# EAGLE design sdmapper (EAGLE 9.6.2)
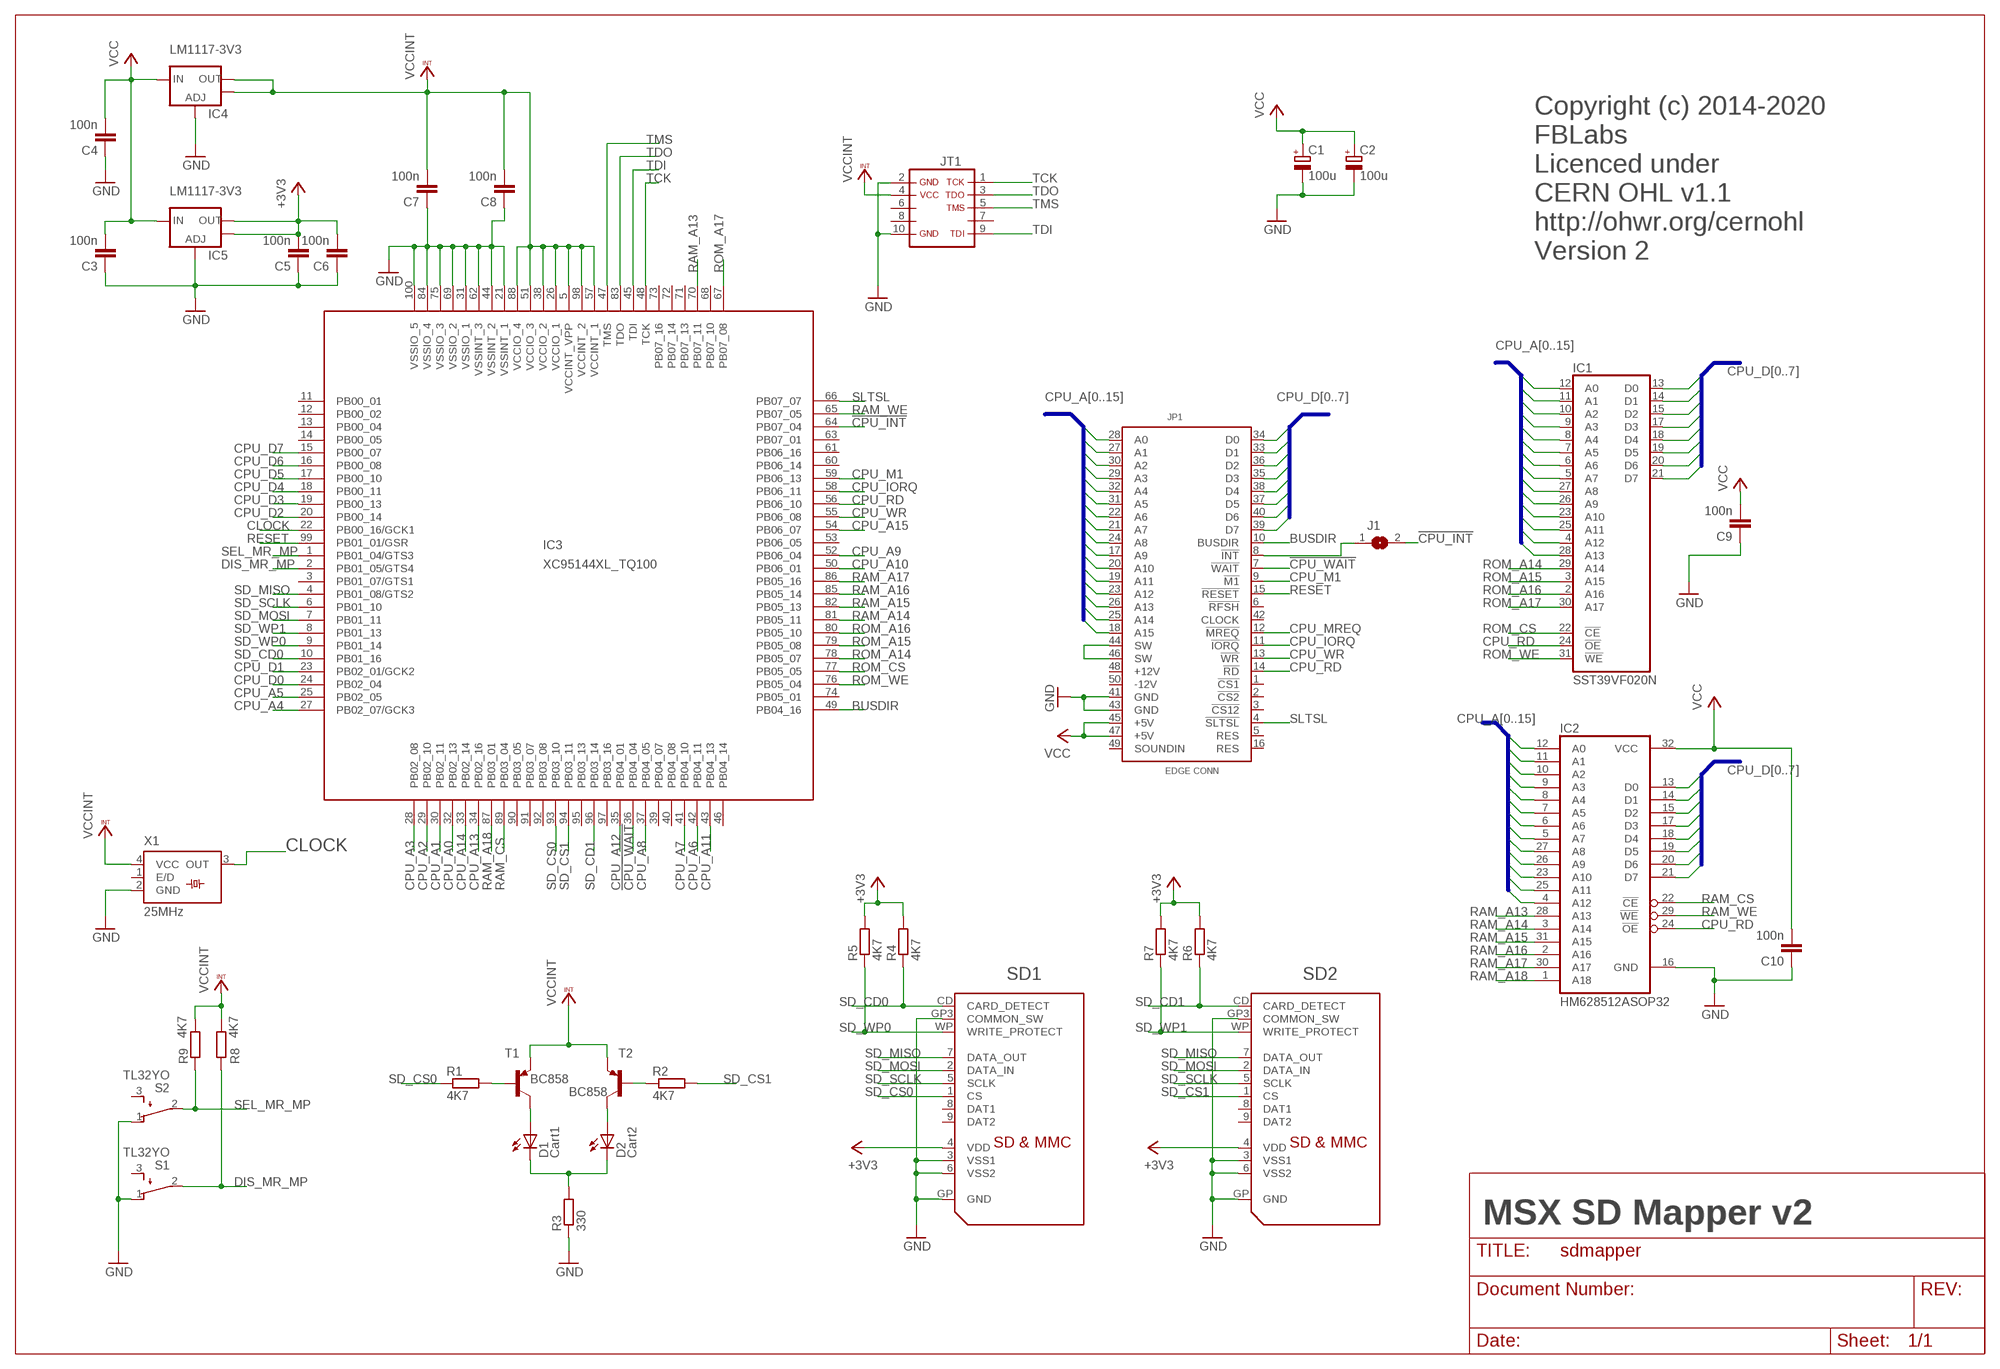
[diagram p0: schematic, sheet 1]

## Parts
C1  100u  CPOL-EUE3,5-6  [E3,5-6]
C2  100u  CPOL-EUC  [PANASONIC_C]
C3  100n  C-EUC0805  [C0805]
C4  100n  C-EUC0805  [C0805]
C5  100n  C-EUC0805  [C0805]
C6  100n  C-EUC0805  [C0805]
C7  100n  C-EUC0805  [C0805]
C8  100n  C-EUC0805  [C0805]
C9  100n  C-EUC0805  [C0805]
C10  100n  C-EUC0805  [C0805]
D1  Cart1  LED3MM  [LED3MM]
D2  Cart2  LED3MM  [LED3MM]
IC1  SST39VF020N  [PLCC32R]
IC2  HM628512ASOP32  [SOP32]
IC3  XC95144XL_TQ100  [XC-TQ100]
IC4  LM1117-3V3  V_REG_LM1117SOT223  [SOT223]
IC5  LM1117-3V3  V_REG_LM1117SOT223  [SOT223]
J1  SJ4  [SJ20]
JP1  MSXCART1  [MSXCART]
JT1  JTAG1B  [SMD5X2]
R1  4K7  R-EU_R0805  [R0805]
R2  4K7  R-EU_R0805  [R0805]
R3  330  R-EU_R0805  [R0805]
R4  4K7  R-EU_R0805  [R0805]
R5  4K7  R-EU_R0805  [R0805]
R6  4K7  R-EU_R0805  [R0805]
R7  4K7  R-EU_R0805  [R0805]
R8  4K7  R-EU_R0805  [R0805]
R9  4K7  R-EU_R0805  [R0805]
S1  TL32YO  [TL3XYO]
S2  TL32YO  [TL3XYO]
SD1  SDMMC06132  [06132]
SD2  SDMMC06132  [06132]
T1  BC858  BC858A-PNP-SOT23-BEC  [SOT23-BEC]
T2  BC858  BC858A-PNP-SOT23-BEC  [SOT23-BEC]
X1  25MHz  SM77H  [SM77H]

## Nets
!CPU_INT: IC3.64(PB07_04) J1.2
!CPU_WAIT: IC3.36(PB04_04) JP1.7(!WAIT)
+3V3 [power]: C5.2 C6.2 IC5.2(OUT) IC5.4(OUT) R4.2 R5.2 R6.2 R7.2 SD1.4(VDD) SD2.4(VDD)
BUSDIR: IC3.49(PB04_16) JP1.10(BUSDIR)
CLOCK: IC3.22(PB00_16/GCK1) X1.3(OUT)
CPU_A0: IC1.12(A0) IC2.12(A0) IC3.32(PB02_13) JP1.28(A0)
CPU_A1: IC1.11(A1) IC2.11(A1) IC3.30(PB02_11) JP1.27(A1)
CPU_A2: IC1.10(A2) IC2.10(A2) IC3.29(PB02_10) JP1.30(A2)
CPU_A3: IC1.9(A3) IC2.9(A3) IC3.28(PB02_08) JP1.29(A3)
CPU_A4: IC1.8(A4) IC2.8(A4) IC3.27(PB02_07/GCK3) JP1.32(A4)
CPU_A5: IC1.7(A5) IC2.7(A5) IC3.25(PB02_05) JP1.31(A5)
CPU_A6: IC1.6(A6) IC2.6(A6) IC3.42(PB04_11) JP1.22(A6)
CPU_A7: IC1.5(A7) IC2.5(A7) IC3.41(PB04_10) JP1.21(A7)
CPU_A8: IC1.27(A8) IC2.27(A8) IC3.37(PB04_05) JP1.24(A8)
CPU_A9: IC1.26(A9) IC2.26(A9) IC3.52(PB06_04) JP1.17(A9)
CPU_A10: IC1.23(A10) IC2.23(A10) IC3.50(PB06_01) JP1.20(A10)
CPU_A11: IC1.25(A11) IC2.25(A11) IC3.43(PB04_13) JP1.19(A11)
CPU_A12: IC1.4(A12) IC2.4(A12) IC3.35(PB04_01) JP1.23(A12)
CPU_A13: IC1.28(A13) IC3.34(PB02_16) JP1.26(A13)
CPU_A14: IC3.33(PB02_14) JP1.25(A14)
CPU_A15: IC3.54(PB06_07) JP1.18(A15)
CPU_D0: IC1.13(D0) IC2.13(D0) IC3.24(PB02_04) JP1.34(D0)
CPU_D1: IC1.14(D1) IC2.14(D1) IC3.23(PB02_01/GCK2) JP1.33(D1)
CPU_D2: IC1.15(D2) IC2.15(D2) IC3.20(PB00_14) JP1.36(D2)
CPU_D3: IC1.17(D3) IC2.17(D3) IC3.19(PB00_13) JP1.35(D3)
CPU_D4: IC1.18(D4) IC2.18(D4) IC3.18(PB00_11) JP1.38(D4)
CPU_D5: IC1.19(D5) IC2.19(D5) IC3.17(PB00_10) JP1.37(D5)
CPU_D6: IC1.20(D6) IC2.20(D6) IC3.16(PB00_08) JP1.40(D6)
CPU_D7: IC1.21(D7) IC2.21(D7) IC3.15(PB00_07) JP1.39(D7)
CPU_IORQ: IC3.58(PB06_11) JP1.11(!IORQ)
CPU_M1: IC3.59(PB06_13) JP1.9(!M1)
CPU_MREQ: JP1.12(!MREQ)
CPU_RD: IC1.24(!OE) IC2.24(!OE) IC3.56(PB06_10) JP1.14(!RD)
CPU_WR: IC3.55(PB06_08) JP1.13(!WR)
DIS_MR_MP: IC3.2(PB01_05/GTS4) R8.1 S1.2(P)
GND [power]: C1.- C2.- C3.1 C4.1 C5.1 C6.1 C7.1 C8.1 C9.1 C10.1 IC2.16(GND) IC3.21(VSSINT_1) IC3.31(VSSIO_1) IC3.44(VSSINT_2) IC3.62(VSSINT_3) IC3.69(VSSIO_2) IC3.75(VSSIO_3) IC3.84(VSSIO_4) IC3.100(VSSIO_5) IC4.1(ADJ) IC5.1(ADJ) JP1.41(GND) JP1.43(GND) JT1.2 JT1.10 R3.1 S1.1(O) S2.1(O) SD1.3(VSS1) SD1.6(VSS2) SD1.GP3(COMMON_SW) SD1.GP(GND) SD2.3(VSS1) SD2.6(VSS2) SD2.GP3(COMMON_SW) SD2.GP(GND) X1.2(GND)
N$1: JP1.44(SW) JP1.46(SW)
N$2: J1.1 JP1.8(!INT)
N$4: R1.2 T1.B
N$5: R2.1 T2.B
N$7: D1.K(C) D2.K(C) R3.2
N$8: D1.A T1.C
N$9: D2.A T2.C
RAM_A13: IC2.28(A13) IC3.70(PB07_11)
RAM_A14: IC2.3(A14) IC3.81(PB05_11)
RAM_A15: IC2.31(A15) IC3.82(PB05_13)
RAM_A16: IC2.2(A16) IC3.85(PB05_14)
RAM_A17: IC2.30(A17) IC3.86(PB05_16)
RAM_A18: IC2.1(A18) IC3.87(PB03_01)
RAM_CS: IC2.22(!CE) IC3.89(PB03_04)
RAM_WE: IC2.29(!WE) IC3.65(PB07_05)
RESET: IC3.99(PB01_01/GSR) JP1.15(!RESET)
ROM_A14: IC1.29(A14) IC3.78(PB05_07)
ROM_A15: IC1.3(A15) IC3.79(PB05_08)
ROM_A16: IC1.2(A16) IC3.80(PB05_10)
ROM_A17: IC1.30(A17) IC3.67(PB07_08)
ROM_CS: IC1.22(!CE) IC3.77(PB05_05)
ROM_WE: IC1.31(!WE) IC3.76(PB05_04)
SD_CD0: IC3.10(PB01_16) R4.1 SD1.CD(CARD_DETECT)
SD_CD1: IC3.96(PB03_14) R6.1 SD2.CD(CARD_DETECT)
SD_CS0: IC3.93(PB03_10) R1.1 SD1.1(CS)
SD_CS1: IC3.94(PB03_11) R2.2 SD2.1(CS)
SD_MISO: IC3.4(PB01_08/GTS2) SD1.7(DATA_OUT) SD2.7(DATA_OUT)
SD_MOSI: IC3.7(PB01_11) SD1.2(DATA_IN) SD2.2(DATA_IN)
SD_SCLK: IC3.6(PB01_10) SD1.5(SCLK) SD2.5(SCLK)
SD_WP0: IC3.9(PB01_14) R5.1 SD1.WP(WRITE_PROTECT)
SD_WP1: IC3.8(PB01_13) R7.1 SD2.WP(WRITE_PROTECT)
SEL_MR_MP: IC3.1(PB01_04/GTS3) R9.1 S2.2(P)
SLTSL: IC3.66(PB07_07) JP1.4(!SLTSL)
TCK: IC3.48(TCK) JT1.1
TDI: IC3.45(TDI) JT1.9
TDO: IC3.83(TDO) JT1.3
TMS: IC3.47(TMS) JT1.5
VCC [power]: C1.+ C2.+ C3.2 C4.2 C9.2 C10.2 IC2.32(VCC) IC4.3(IN) IC5.3(IN) JP1.45(+5V) JP1.47(+5V)
VCCINT [power]: C7.2 C8.2 IC3.5(VCCINT_VPP) IC3.26(VCCIO_1) IC3.38(VCCIO_2) IC3.51(VCCIO_3) IC3.57(VCCINT_1) IC3.88(VCCIO_4) IC3.98(VCCINT_2) IC4.2(OUT) IC4.4(OUT) JT1.4 R8.2 R9.2 T1.E T2.E X1.4(VCC)
Unconnected: IC3.3(PB01_07/GTS1) IC3.11(PB00_01) IC3.12(PB00_02) IC3.13(PB00_04) IC3.14(PB00_05) IC3.39(PB04_07) IC3.40(PB04_08) IC3.46(PB04_14) IC3.53(PB06_05) IC3.60(PB06_14) IC3.61(PB06_16) IC3.63(PB07_01) IC3.68(PB07_10) IC3.71(PB07_13) IC3.72(PB07_14) IC3.73(PB07_16) IC3.74(PB05_01) IC3.90(PB03_05) IC3.91(PB03_07) IC3.92(PB03_08) IC3.95(PB03_13) IC3.97(PB03_16) JP1.1(!CS1) JP1.2(!CS2) JP1.3(!CS12) JP1.5(RES) JP1.6(!RFSH) JP1.16(RES) JP1.42(CLOCK) JP1.48(+12V) JP1.49(SOUNDIN) JP1.50(-12V) JT1.6 JT1.7 JT1.8 S1.3(S) S2.3(S) SD1.8(DAT1) SD1.9(DAT2) SD2.8(DAT1) SD2.9(DAT2) X1.1(E/D)

## Buses
CPU_A[0..15]
CPU_D[0..7]

## Notes on the sheet
- Copyright (c) 2014-2020
  FBLabs
  Licenced under
  CERN OHL v1.1
  http://ohwr.org/cernohl
  Version 2
- SD1 | SD2
- MSX SD Mapper v2

## Power pins joined to a net without a drawn wire
GND: IC1.16(GND)
VCC: IC1.32(VCC)

## Library data of the parts
C1 = rcl2:CPOL-EU: POLARIZED CAPACITOR, European symbol
C2 = rcl:CPOL-EU: POLARIZED CAPACITOR, European symbol
C3-C10 = rcl:C-EU: CAPACITOR, European symbol
D1 D2 = led:LED: LED OSRAM: - CHIPLED LG R971, LG N971, LY N971, LG Q971, LY Q971, LO R971, LY R971 LH N974, LH R974 LS Q976, LO Q976, LY Q976 LO Q996 - Hyper CHIPLED LW Q18S LB Q993, LB Q99A, LB R99A - SideLED LS A670, LO A670, LY A670, LG A670, LP A670 LB A673, LV A673, LT A673, LW A673 LH A674 LY A675 LS A676, LA A676, LO A676, LY A676, LW A676 LS A679, LY A679, LG A679 - Hyper Micro SIDELED® LS Y876, LA Y876, LO Y876, LY Y876 LT Y87S - SmartLED LW L88C, LW L88S LB L89C, LB L89S, LG L890 LS L89K, LO L89K, LY L89K LS L896, LA L896, LO L896, LY L896 - TOPLED LS T670, LO T670, LY T670, LG T670, LP T670 LSG T670, LSP T670, LSY T670, LOP T670, LYG T670 LG T671, LOG T671, LSG T671 LB T673, LV T673, LT T673, LW T673 LH T674 LS T676, LA T676, LO T676, LY T676, LB T676, LH T676, LSB T676, LW T676 LB T67C, LV T67C, LT T67C, LS T67K, LO T67K, LY T67K, LW E67C LS E67B, LA E67B, LO E67B, LY E67B, LB E67C, LV E67C, LT E67C LW T67C LS T679, LY T679, LG T679 LS T770, LO T770, LY T770, LG T770, LP T770 LB T773, LV T773, LT T773, LW T773 LH T774 LS E675, LA E675, LY E675, LS T675 LS T776, LA T776, LO T776, LY T776, LB T776 LHGB T686 LT T68C, LB T68C - Hyper Mini TOPLED® LB M676 - Mini TOPLED Santana® LG M470 LS M47K, LO M47K, LY M47K Source: http://www.osram.convergy.de LUXEON: - LUMILED® LXK2-PW12-R00, LXK2-PW12-S00, LXK2-PW14-U00, LXK2-PW14-V00 LXK2-PM12-R00, LXK2-PM12-S00, LXK2-PM14-U00 LXK2-PE12-Q00, LXK2-PE12-R00, LXK2-PE12-S00, LXK2-PE14-T00, LXK2-PE14-U00 LXK2-PB12-K00, LXK2-PB12-L00, LXK2-PB12-M00, LXK2-PB14-N00, LXK2-PB14-P00, LXK2-PB14-Q00 LXK2-PR12-L00, LXK2-PR12-M00, LXK2-PR14-Q00, LXK2-PR14-R00 LXK2-PD12-Q00, LXK2-PD12-R00, LXK2-PD12-S00 LXK2-PH12-R00, LXK2-PH12-S00 LXK2-PL12-P00, LXK2-PL12-Q00, LXK2-PL12-R00 Source: www.luxeon.com KINGBRIGHT: KA-3528ASYC Source: www.kingbright.com
IC1 = memory:SST39VF020: 2 Mbit x8 Multi-Purpose Flash Source: http://www.sst.com/dotAsset/40782.pdf
IC2 = hitachi_sram_hm628512a-series_rev1:HM628512A: 4M SRAM 512kword x 8bit
IC3 = XC:XC95144XL_TQ100: xc95144xl_tq100 edit this description Auto generated by make-symbol-device-package-bsdl.ulp Rev. 34 Source: xc95144xl_tq100.bsd
IC4 IC5 = SparkFun-PowerIC:V_REG_LM1117: Voltage Regulator LM1117 Standard adjustable voltage regulator but in SMD form. Spark Fun Electronics SKU : COM-00595
J1 = fabio:SJ: SMD solder JUMPER
JP1 = msx-con:MSXCART
JT1 = JTAGs:JTAG1: PIN HEADER
R1-R9 = rcl:R-EU_: RESISTOR, European symbol
S1 S2 = comps:TL32YO: TINY SWITCH ON - MOM Source: http://www2.produktinfo.conrad.com/datenblaetter/700000-724999/705152-da-01-de-Subminiaturschalter_TL_36YO.pdf
SD1 SD2 = adafruit:SDMMC: SD MMC Card holder 4UCON part #06132 - easy to solder
T1 T2 = transistor:*-PNP-: PNP Transistror
X1 = comps:SM77H: 3.3V CMOS Clock Oscillator Source: www.pletronics.com .. sm77h%203.3v.pdf; OC_FARNELL: unknown; OC_NEWARK: unknown

## Net classes
0 default: width 0.152 mm, drill 0.381 mm
1 power: width 0.406 mm, drill 0.5 mm

## Board
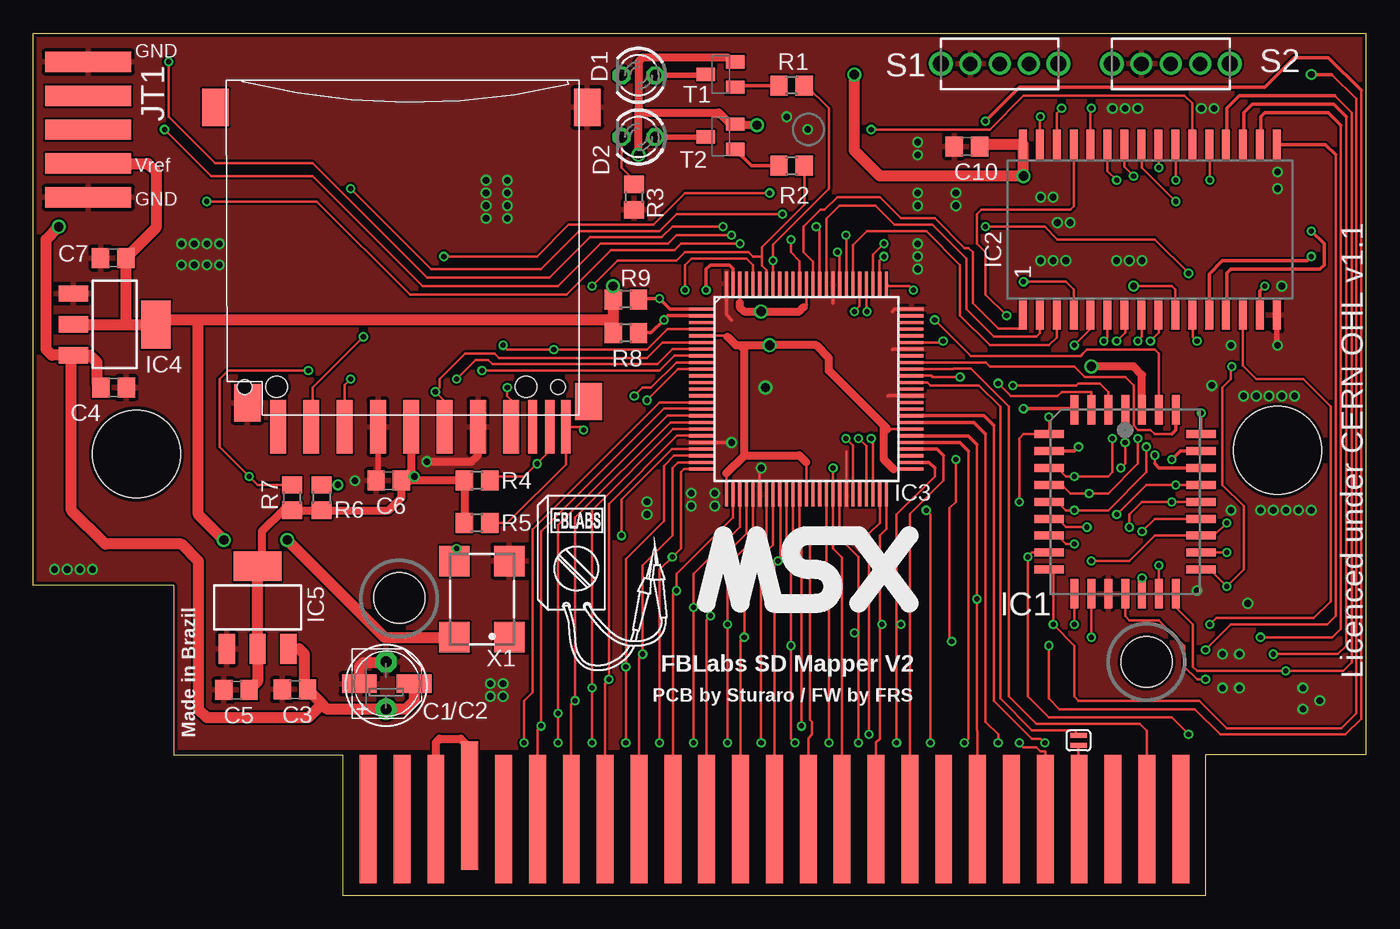
[diagram p1: board, top side]
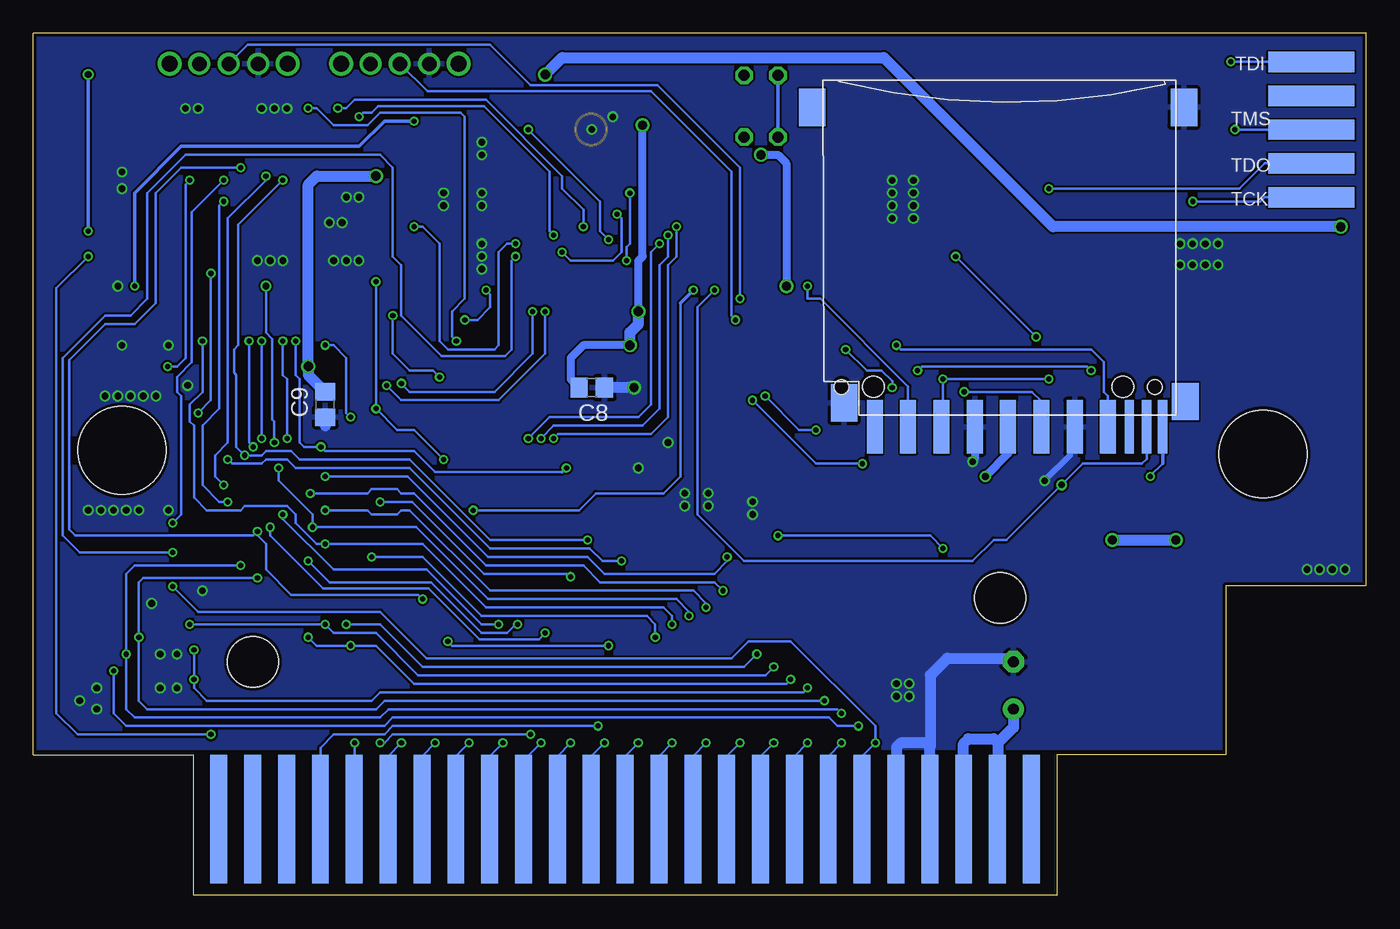
[diagram p2: board, bottom side, seen from below]

Size 100 x 64.68 mm. Coordinates in mm from the lower left corner, seen from the top.
Copper layers (1*16): Top 0.035mm / dielectric 1.5mm / Bottom 0.035mm
Design rules "ITEADstudio(6mil) *": minimum track width 6mil, minimum drill 12mil, track to track 6mil, track to pad 6mil, pad to pad 6mil, via to via 6mil, smd to smd 0mil, copper to edge 10mil, drill to drill 10mil, minimum pad ring 10mil, minimum via ring 6mil, stop-mask expansion 2mil, vias tented up to drill 100mil, thermal gap 10mil

### Footprints (pad centres in the part's own frame; a part is rotated, then mirrored left to right if it is on the bottom)
E3,5-6 = drill 0.813 pad 1.6: + -1.778,0 | drill 0.813 pad 1.6 octagon: - 1.778,0
PANASONIC_C = smd 2.6 x 1.4: + 2.05,0; - -2.05,0
C0805 = smd 1.3 x 1.5: 1 -0.95,0; 2 0.95,0
LED3MM = drill 0.813 octagon: A -1.27,0; K 1.27,0
PLCC32R = smd 0.6 x 2.2: 1 0,6.9; 2 -1.27,6.9; 3 -2.54,6.9; 4 -3.81,6.9; 14 -3.81,-6.9; 15 -2.54,-6.9; 16 -1.27,-6.9; 17 0,-6.9; 18 1.27,-6.9; 19 2.54,-6.9; 20 3.81,-6.9; 30 3.81,6.9; 31 2.54,6.9; 32 1.27,6.9 | smd 2.2 x 0.6: 5 -5.7,5.08; 6 -5.7,3.81; 7 -5.7,2.54; 8 -5.7,1.27; 9 -5.7,0; 10 -5.7,-1.27; 11 -5.7,-2.54; 12 -5.7,-3.81; 13 -5.7,-5.08; 21 5.7,-5.08; 22 5.7,-3.81; 23 5.7,-2.54; 24 5.7,-1.27; 25 5.7,0; 26 5.7,1.27; 27 5.7,2.54; 28 5.7,3.81; 29 5.7,5.08
SOP32 = smd 0.6 x 2.2: 1 -9.525,-5.765; 2 -8.255,-5.765; 3 -6.985,-5.765; 4 -5.715,-5.765; 5 -4.445,-5.765; 6 -3.175,-5.765; 7 -1.905,-5.765; 8 -0.635,-5.765; 9 0.635,-5.765; 10 1.905,-5.765; 11 3.175,-5.765; 12 4.445,-5.765; 13 5.715,-5.765; 14 6.985,-5.765; 15 8.255,-5.765; 16 9.525,-5.765; 17 9.525,7.035; 18 8.255,7.035; 19 6.985,7.035; 20 5.715,7.035; 21 4.445,7.035; 22 3.175,7.035; 23 1.905,7.035; 24 0.635,7.035; 25 -0.635,7.035; 26 -1.905,7.035; 27 -3.175,7.035; 28 -4.445,7.035; 29 -5.715,7.035; 30 -6.985,7.035; 31 -8.255,7.035; 32 -9.525,7.035
XC-TQ100 = smd 1.8 x 0.241: 1 -7.9,6; 2 -7.9,5.5; 3 -7.9,5; 4 -7.9,4.5; 5 -7.9,4; 6 -7.9,3.5; 7 -7.9,3; 8 -7.9,2.5; 9 -7.9,2; 10 -7.9,1.5; 11 -7.9,1; 12 -7.9,0.5; 13 -7.9,0; 14 -7.9,-0.5; 15 -7.9,-1; 16 -7.9,-1.5; 17 -7.9,-2; 18 -7.9,-2.5; 19 -7.9,-3; 20 -7.9,-3.5; 21 -7.9,-4; 22 -7.9,-4.5; 23 -7.9,-5; 24 -7.9,-5.5; 25 -7.9,-6; 51 7.9,-6; 52 7.9,-5.5; 53 7.9,-5; 54 7.9,-4.5; 55 7.9,-4; 56 7.9,-3.5; 57 7.9,-3; 58 7.9,-2.5; 59 7.9,-2; 60 7.9,-1.5; 61 7.9,-1; 62 7.9,-0.5; 63 7.9,0; 64 7.9,0.5; 65 7.9,1; 66 7.9,1.5; 67 7.9,2; 68 7.9,2.5; 69 7.9,3; 70 7.9,3.5; 71 7.9,4; 72 7.9,4.5; 73 7.9,5; 74 7.9,5.5; 75 7.9,6 | smd 0.241 x 1.8: 26 -6,-7.9; 27 -5.5,-7.9; 28 -5,-7.9; 29 -4.5,-7.9; 30 -4,-7.9; 31 -3.5,-7.9; 32 -3,-7.9; 33 -2.5,-7.9; 34 -2,-7.9; 35 -1.5,-7.9; 36 -1,-7.9; 37 -0.5,-7.9; 38 0,-7.9; 39 0.5,-7.9; 40 1,-7.9; 41 1.5,-7.9; 42 2,-7.9; 43 2.5,-7.9; 44 3,-7.9; 45 3.5,-7.9; 46 4,-7.9; 47 4.5,-7.9; 48 5,-7.9; 49 5.5,-7.9; 50 6,-7.9; 76 6,7.9; 77 5.5,7.9; 78 5,7.9; 79 4.5,7.9; 80 4,7.9; 81 3.5,7.9; 82 3,7.9; 83 2.5,7.9; 84 2,7.9; 85 1.5,7.9; 86 1,7.9; 87 0.5,7.9; 88 0,7.9; 89 -0.5,7.9; 90 -1,7.9; 91 -1.5,7.9; 92 -2,7.9; 93 -2.5,7.9; 94 -3,7.9; 95 -3.5,7.9; 96 -4,7.9; 97 -4.5,7.9; 98 -5,7.9; 99 -5.5,7.9; 100 -6,7.9
SOT223 = smd 1.219 x 2.235: 1 -2.311,-3.099; 2 0,-3.099; 3 2.311,-3.099 | smd 3.6 x 2.2: 4 0,3.099
SJ20 = smd 0.381 x 1.27: 1 -0.508,0; 2 0.254,0
MSXCART = smd 1.27 x 9.652 bottom: 1 86.081,5.715; 3 83.541,5.715; 5 81.001,5.715; 7 78.461,5.715; 9 75.921,5.715; 11 73.381,5.715; 13 70.841,5.715; 15 68.301,5.715; 17 65.761,5.715; 19 63.221,5.715; 21 60.681,5.715; 23 58.141,5.715; 25 55.601,5.715; 27 53.061,5.715; 29 50.521,5.715; 31 47.981,5.715; 33 45.441,5.715; 35 42.901,5.715; 37 40.361,5.715; 39 37.821,5.715; 41 35.281,5.715; 43 32.741,5.715; 45 30.201,5.715; 47 27.661,5.715; 49 25.121,5.715 | smd 1.27 x 9.652: 2 86.081,5.715; 4 83.541,5.715; 6 81.001,5.715; 8 78.461,5.715; 10 75.921,5.715; 12 73.381,5.715; 14 70.841,5.715; 16 68.301,5.715; 18 65.761,5.715; 20 63.221,5.715; 22 60.681,5.715; 24 58.141,5.715; 26 55.601,5.715; 28 53.061,5.715; 30 50.521,5.715; 32 47.981,5.715; 34 45.441,5.715; 36 42.901,5.715; 38 40.361,5.715; 40 37.821,5.715; 42 35.281,5.715; 44 32.741,6.731; 46 30.201,5.715; 48 27.661,5.715; 50 25.121,5.715 | hole 3.81: 27.461,22.326; 83.53,17.526 | hole 6.604: 93.349,33.388; 7.742,33.118
SMD5X2 = smd 1.524 x 6.477 bottom: 1 -5.08,3.81; 3 -2.54,3.81; 5 0,3.81; 7 2.54,3.81; 9 5.08,3.81 | smd 1.524 x 6.477: 2 -5.08,3.81; 4 -2.54,3.81; 6 0,3.81; 8 2.54,3.81; 10 5.08,3.81
R0805 = smd 1.3 x 1.5: 1 -0.95,0; 2 0.95,0
TL3XYO = drill 1.1: 1 -2.21,0; 2 0,0; 3 2.21,0 | drill 1.2: M1 -4.42,0; M2 4.42,0
06132 = smd 1.2 x 4: 1 6.9,0.9; 2 4.4,0.9; 3 1.9,0.9; 4 -0.6,0.9; 5 -3.1,0.9; 6 -5.6,0.9; 7 -8.1,0.9; 9 9.4,0.9 | smd 0.7 x 4: 8 -9.7,0.9; CD -11,0.9; WP -12.2,0.9 | smd 2 x 2.8: GP -13.8,-23.07; GP2 14.1,-23.07; GP3 11.7,-0.9; GP4 -13.9,-1 | hole 1.1: -11.6,-2.1 | hole 1.6: 9.5,-2.1
SOT23-BEC = smd 1 x 1.4: B -0.95,-1.1; C 0,1.1; E 0.95,-1.1
SM77H = smd 2.286 x 2.286: 1 -2.861,-2.056; 2 2.861,-2.056; 3 2.861,2.056; 4 -2.861,2.056

### Placement (x,y rotation side)
C1  26.47,15.75 90 top
C2  26.51,15.88 0 top
C3  19.63,15.44 0 top
C4  6.03,38.1 180 top
C5  15.24,15.4 0 top
C6  26.67,31.11 0 top
C7  5.99,47.83 0 top
C8  58.1,38.1 180 bottom
C9  78.11,36.83 90 bottom
C10  70.04,56.18 0 top
D1  45.4,61.53 180 top
D2  45.4,56.9 180 top
IC1  81.92,29.53 0 top
IC2  83.77,49.3 0 top
IC3  58,37.99 0 top
IC4  6.11,42.84 270 top
IC5  16.83,21.59 0 top
J1  78.42,11.75 90 top
JP1  0,0 0 top
JT1  7.92,57.45 90 top
R1  56.9,60.77 180 top
R2  56.9,54.74 0 top
R3  45.09,52.39 90 top
R4  33.29,31.11 180 top
R5  33.29,27.94 180 top
R6  21.62,29.84 270 top
R7  19.4,29.84 270 top
R8  44.45,42.18 180 top
R9  44.45,44.72 180 top
S1  72.5,62.39 0 top
S2  85.34,62.39 0 top
SD1  27.76,36.06 180 top
SD2  27.47,36.06 180 bottom
T1  51.56,61.59 90 top
T2  51.56,56.91 90 top
U$1  [LOGO_FABIO_SILK_400MIL]  37.78,16.83 0 top
U$3  [MSX_SILK]  58.1,24.45 0 top
X1  33.66,22.23 90 top

### Tracks (layer width: path | path; a pad name or v marks a point on that pad's centre or on a via)
!CPU_INT
  Top 0.203: IC3.64 67.08,38.49 67.31,38.26 70.96,38.26 72.55,36.67 72.55,14.76 74.93,12.38 78.11,12.38 78.42,12.06 J1.2
!CPU_WAIT  (via drill 0.38)
  Top 0.203: v57.63,12.7 57.63,26.19 57,26.82 IC3.36
  Bottom 0.203: JP1.7 78.46,11.07 77.47,12.06 73.66,12.06 73.03,12.7 v57.63,12.7
+3V3  (via drill 0.5)
  Top 0.61: SD1.4 28.36,31.86 C6.2 | v28.57,31.43 28.26,31.12 C6.2 | R5.2 R4.2 C6.2 | C6.2 27.62,30.8 27.62,29.84 26.66,28.89 R6.2 R7.2 18.73,28.89 17.14,27.3 17.14,25.01 IC5.4
  Top 0.813: IC5.4 IC5.2 16.83,16.04 C5.2
  Bottom 0.61: SD2.4 26.87,33.13 v28.57,31.43
BUSDIR  (via drill 0.38)
  Top 0.203: JP1.10 75.92,10.76 75.88,10.79 75.56,10.79 75.25,11.11 74.3,11.11 v73.98,11.43 | v62.71,12.06 62.71,27.15 63.5,27.94 IC3.49
  Bottom 0.203: v73.98,11.43 73.66,11.43 73.03,12.06 v62.71,12.06
CLOCK  (via drill 0.38)
  Top 0.203: IC3.22 47.93,33.49 44.13,29.69 v44.13,26.99 | X1.3 31.6,25.88 v31.75,26.04
  Bottom 0.203: v44.13,26.99 32.7,26.99 v31.75,26.04
CPU_A0  (via drill 0.38)
  Top 0.203: IC3.32 55,26.74 53.34,25.08 v53.34,19.37 53.06,19.09 JP1.28 | 76.83,25.72 IC1.12 74.93,25.72 v74.61,25.4 74.61,14.92 76.2,13.34 85.41,13.34 v86.68,12.06
  Top 0.254: IC2.12 88.21,46.62 89.22,47.62 95.57,47.62 v95.89,47.94
  Bottom 0.203: v53.34,19.37 53.34,20.32 53.98,20.95 66.36,20.95 70.8,25.4 v74.61,25.4 | v95.89,47.94 98.27,45.56 98.27,13.65 96.68,12.06 v86.68,12.06
CPU_A1  (via drill 0.38)
  Top 0.203: v52.07,11.43 v52.07,20.32 52.07,24.77 53.98,26.67 53.98,30.06 IC3.30 | IC1.11 76.83,26.99 77.47,26.35 v78.11,26.35 | v87.31,41.59 87,41.9 IC2.11
  Bottom 0.203: v52.07,20.32 52.07,20.95 52.7,21.59 66.04,21.59 70.8,26.35 v78.11,26.35 78.74,26.35 80.33,27.94 80.33,28.57 80.96,29.21 84.14,29.21 84.45,28.89 87,28.89 87.95,29.84 87.95,35.24 88.27,35.56 88.27,36.83 87.31,37.78 v87.31,41.59 | JP1.27 53.06,10.44 v52.07,11.43
CPU_A2  (via drill 0.38, 0.5)
  Top 0.203: IC3.29 53.5,27.15 50.8,24.45 v50.8,20.95 50.52,20.68 JP1.30 | IC1.10 76.83,28.26 77.47,27.62 v79.06,27.62 | IC2.10 85.67,45.45 85.41,45.72 v82.55,45.72 | v81.6,32.07 81.92,32.38 v81.92,33.97
  Bottom 0.203: v50.8,20.95 50.8,21.27 51.75,22.23 65.88,22.23 71.28,27.62 v79.06,27.62 79.06,28.57 81.6,31.11 v81.6,32.07 | v82.55,45.72 82.55,42.23 82.07,41.75 82.07,35.72 81.92,35.56 v81.92,33.97
CPU_A3  (via drill 0.38)
  Top 0.203: v49.53,11.43 v49.53,21.59 49.53,24.13 53.02,27.62 53.02,30.06 IC3.28 | IC1.9 76.83,29.53 77.47,28.89 v78.11,28.89 80.64,28.89 83.5,31.75 v83.5,33.66 | v83.82,41.59 84.45,42.23 84.45,43.49 IC2.9
  Bottom 0.203: v49.53,21.59 49.53,21.91 50.48,22.86 65.72,22.86 71.75,28.89 72.39,28.89 72.71,28.57 74.61,28.57 74.93,28.89 v78.11,28.89 | JP1.29 50.52,10.44 v49.53,11.43 | v83.82,41.59 83.82,33.97 v83.5,33.66
CPU_A4  (via drill 0.38)
  Top 0.203: JP1.32 47.98,22.58 v48.26,22.86 48.26,24.13 52.5,28.37 IC3.27 | IC1.8 76.09,30.67 77.28,30.67 77.79,30.16 v79.22,30.16 80.64,30.16 82.87,32.38 v82.87,34.29 | v82.87,41.59 83.19,41.91 83.19,43.49 IC2.8
  Bottom 0.203: v48.26,22.86 48.9,23.5 57.47,23.5 58.74,24.77 66.04,24.77 71.44,30.16 72.39,30.16 72.71,30.48 74.61,30.48 74.93,30.16 v79.22,30.16 | v82.87,34.29 v82.87,41.59
CPU_A5  (via drill 0.38)
  Top 0.203: v46.99,11.43 46.99,24.45 v47.94,25.4 48.58,26.04 48.58,31.75 48.81,31.99 IC3.25 | 76.83,32.07 77.47,31.43 v78.11,31.43 80.64,31.43 80.96,31.75 v80.96,34.29 | v81.28,41.59 81.92,42.23 81.92,43.49 IC2.7
  Top 0.254: IC1.7 76.83,32.07
  Bottom 0.203: v78.11,31.43 71.91,31.43 65.88,25.4 58.42,25.4 57.15,24.13 48.9,24.13 47.94,25.08 v47.94,25.4 | JP1.31 47.98,10.44 v46.99,11.43 | v80.96,34.29 80.96,38.73 81.28,39.05 v81.28,41.59
CPU_A6  (via drill 0.38)
  Top 0.203: JP1.22 60.68,25.36 60.01,26.04 60.01,30.07 IC3.42 v60.01,32.07 | IC2.6 80.59,41.86 v80.33,41.59
  Top 0.254: IC1.6 78.11,33.34 v78.42,33.66
  Bottom 0.203: 60.33,31.75 69.85,31.75 71.44,33.34 78.11,33.34 v78.42,33.66 79.69,33.66 80.01,33.97 80.01,38.73 80.33,39.05 v80.33,41.59
  Bottom 0.254: 60.33,31.75 v60.01,32.07
CPU_A7  (via drill 0.38)
  Top 0.203: v59.69,11.43 v59.69,23.9 59.5,24.1 IC3.41 | v73.98,29.53 73.98,34.29 74.3,34.61 IC1.5 76.22,35.86 v76.2,35.88 | IC2.5 79.32,42.49 v78.11,41.27
  Bottom 0.203: v73.98,29.53 71.6,29.53 66.2,24.13 59.92,24.13 v59.69,23.9 | JP1.21 60.68,10.44 v59.69,11.43 | v78.11,41.27 77.47,41.27 76.52,40.32 76.52,36.2 v76.2,35.88
CPU_A8  (via drill 0.38)
  Top 0.203: IC3.37 57.47,30.06 57.47,27.46 58.26,26.67 | JP1.24 58.14,11.79 58.42,12.06 58.42,13.02 58.26,13.18 58.26,26.67 | 58.26,26.67 v58.42,26.67 | v84.14,33.02 84.14,32.38 | IC2.27 80.59,54.34 v81.28,53.66
  Top 0.254: 84.14,32.38 84.45,32.07 IC1.27
  Bottom 0.203: v58.42,26.67 65.72,26.67 71.75,32.7 80.01,32.7 80.64,33.34 82.55,33.34 82.87,33.02 v84.14,33.02 84.77,33.66 84.77,39.05 84.93,39.21 84.93,40.96 84.61,41.27 84.61,50.32 v81.28,53.66
CPU_A9  (via drill 0.38)
  Top 0.203: v64.77,11.43 64.77,20.32 | 64.77,20.32 64.77,28.57 67.63,31.43 67.63,32.07 | v81.28,28.57 83.5,30.8 v85.72,30.8 IC1.26 | v65.09,20.32 64.77,20.32 | IC2.26 81.86,54.66 v82.55,53.98
  Top 0.254: 67.63,32.07 67.21,32.49 IC3.52
  Bottom 0.203: JP1.17 65.76,10.44 v64.77,11.43 | v81.28,28.57 81.28,28.26 77.47,24.45 70.48,24.45 66.36,20.32 v65.09,20.32 | v82.55,53.98 82.55,53.66 85.41,50.8 85.41,33.97 86.36,33.02 86.36,31.43 v85.72,30.8
CPU_A10  (via drill 0.38)
  Top 0.203: IC3.50 64,27.48 63.5,26.99 63.5,20.32 | JP1.20 63.22,11.47 63.5,11.75 63.5,20.32 | v79.38,25.08 82.23,25.08 84.14,26.99 IC1.23 88.58,26.99 v89.53,27.94 | v63.66,20.32 63.5,20.32 | v85.72,53.66 85.72,56.29 IC2.23
  Bottom 0.203: v79.38,25.08 77.79,23.5 70.17,23.5 66.36,19.68 64.45,19.68 63.82,20.32 v63.66,20.32 | v89.53,27.94 88.9,28.57 88.9,37.47 89.22,37.78 89.22,38.89 88.11,40.01 88.11,51.28 v85.72,53.66
CPU_A11  (via drill 0.38)
  Top 0.203: v61.91,11.43 61.91,19.84 | 61.91,19.84 61.91,25.4 60.5,26.82 IC3.43 | IC1.25 v85.41,29.53 83.19,29.53 82.23,28.57 v82.23,27.62 | v85.72,52.07 83.19,54.61 83.19,56.29 IC2.25 | v61.59,19.68 61.75,19.68 61.91,19.84
  Bottom 0.203: JP1.19 63.22,10.12 v61.91,11.43 | v85.41,29.53 86.04,29.53 87.31,30.8 87.31,35.24 86.04,36.51 86.04,51.75 v85.72,52.07 | v82.23,27.62 82.23,26.99 78.26,23.02 70.33,23.02 66.52,19.21 62.07,19.21 v61.59,19.68
CPU_A12  (via drill 0.38)
  Top 0.203: v57.15,11.43 56.83,11.75 v56.83,18.73 56.83,26.04 56.52,26.35 56.52,30.07 IC3.35 | v68.9,19.05 68.74,19.21 68.74,29.05 69.22,29.53 v69.22,32.7 | IC2.4 78.05,45.45 77.47,46.04 v74.3,46.04
  Top 0.254: v74.3,36.51 78.02,36.51 IC1.4
  Bottom 0.203: v56.83,18.73 68.58,18.73 v68.9,19.05 | v69.22,32.7 71.44,34.92 72.71,34.92 v74.3,36.51 v74.3,46.04 | JP1.23 58.14,10.44 v57.15,11.43
CPU_A13  (via drill 0.38)
  Top 0.203: IC3.34 56.04,30.04 56.04,25.24 v55.88,25.08 55.6,24.8 JP1.26
  Top 0.254: IC1.28 86.04,33.34 v85.41,32.7
  Bottom 0.203: v55.88,25.08 57.31,25.08 58.26,26.04 65.72,26.04 71.75,32.07 80.33,32.07 80.96,32.7 82.55,32.7 82.87,32.38 85.09,32.38 v85.41,32.7
CPU_A14  (via drill 0.38)
  Top 0.203: v54.61,11.43 54.61,25.4 55.5,26.29 IC3.33
  Bottom 0.203: JP1.25 55.6,10.44 v54.61,11.43
CPU_A15
  Top 0.203: 68.26,33.02 68.26,31.11 65.76,28.61 JP1.18
  Top 0.254: 68.26,33.02 67.8,33.49 IC3.54
CPU_D0  (via drill 0.38, 0.5)
  Top 0.178: 99.26,59.77 97.43,61.59
  Top 0.203: IC3.24 48.36,32.49 47.94,32.07 47.94,26.99 45.72,24.77 v45.72,18.1 45.44,17.82 JP1.34 | 99.26,59.77 99.26,13.65 98.15,12.54 89.53,12.54 87.47,14.61 78.42,14.61 78.11,14.92 78.11,18.73 v76.52,20.32 76.52,24.45 IC1.13
  Top 0.254: 97.43,61.59 v95.89,61.59 | v95.89,49.85 96.84,48.9 96.84,47.31 96.52,46.99 89.85,46.99 89.53,46.67 89.53,43.59 IC2.13
  Bottom 0.203: v45.72,18.1 46.67,17.14 70.8,17.14 73.98,20.32 v76.52,20.32
  Bottom 0.254: v95.89,61.59 v95.89,49.85
CPU_D1  (via drill 0.38)
  Top 0.178: IC2.14 90.75,39.74 91.76,38.73 95.29,38.73 97.35,36.67
  Top 0.203: v44.45,11.43 v44.45,17.14 44.45,25.24 47.31,28.1 47.31,32.23 48.07,32.99 IC3.23 | 97.35,36.67 97.35,22.07 96.08,20.8 88.74,20.8 v88.27,20.32 | IC1.14 v78.11,20.32
  Bottom 0.203: v44.45,17.14 45.09,16.51 71.12,16.51 74.3,19.68 77.47,19.68 v78.11,20.32 v88.27,20.32 | JP1.33 45.44,10.44 v44.45,11.43
CPU_D2  (via drill 0.38)
  Top 0.203: IC3.20 48.3,34.49 43.18,29.37 v43.18,16.19 42.9,15.91 JP1.36 | v76.2,18.73 76.2,14.76 76.99,13.97 87.15,13.97 89.06,12.06 98.42,12.06 99.62,13.26 99.62,60.4 | v79.38,19.37 IC1.15
  Top 0.254: 99.62,60.4 97.16,62.87 94.61,62.87 92.39,60.64 73.98,60.64 v71.44,58.1 | v92.39,45.72 92.02,45.35 IC2.15
  Bottom 0.203: v43.18,16.19 43.5,15.88 71.44,15.88 74.3,18.73 v76.2,18.73 78.74,18.73 v79.38,19.37
  Bottom 0.254: v71.44,58.1 73.66,58.1 75.56,56.2 88.9,56.2 92.39,52.7 v92.39,45.72
CPU_D3  (via drill 0.38)
  Top 0.203: v41.91,11.43 v41.91,15.56 41.91,28.89 48,34.99 IC3.19 | 97.71,55.56 97.71,20.95 97.08,20.32 89.85,20.32 v87.95,18.41 | IC1.17 81.92,20.95 82.23,20.64 84.45,20.64 86.36,18.73 86.36,17.14 87.31,16.19 v87.95,16.19
  Top 0.254: IC2.17 96.94,56.34 97.71,55.56
  Bottom 0.203: v41.91,15.56 42.23,15.24 73.98,15.24 74.61,14.61 87,14.61 87.95,15.56 v87.95,16.19 v87.95,18.41 | JP1.35 42.9,10.44 v41.91,11.43
CPU_D4  (via drill 0.38)
  Top 0.203: IC3.18 47.79,35.49 40.64,28.34 v40.64,14.61 40.36,14.33 JP1.38 | v92.08,19.37 97.47,19.37 98.11,20 98.11,57.78 | v83.19,23.81 IC1.18
  Top 0.254: 98.11,57.78 97.16,58.74 92.39,58.74 92.08,58.42 92.08,56.39 IC2.18
  Bottom 0.203: v40.64,14.61 73.66,14.61 74.3,13.97 91.44,13.97 92.08,14.61 v92.08,19.37 92.08,23.5 91.76,23.81 v83.19,23.81
CPU_D5  (via drill 0.38)
  Top 0.203: v39.37,11.43 v39.37,13.65 39.37,27.78 47.57,35.99 IC3.17 | v93.03,18.1 97.87,18.1 98.5,18.73 98.5,58.42 | v84.45,24.77 IC1.19
  Top 0.254: 98.5,58.42 97.55,59.37 91.44,59.37 90.81,58.74 90.81,56.39 IC2.19
  Bottom 0.203: v39.37,13.65 39.69,13.97 73.34,13.97 73.98,13.34 92.39,13.34 93.03,13.97 v93.03,18.1 93.03,24.13 92.39,24.77 v84.45,24.77 | JP1.37 40.36,10.44 v39.37,11.43
CPU_D6  (via drill 0.38)
  Top 0.178: 98.9,58.74 97.63,60.01
  Top 0.203: IC3.16 50.07,36.51 47.31,36.51 38.1,27.3 v38.1,12.7 37.82,12.42 JP1.40 | 98.9,58.74 98.9,17.46 98.27,16.83 v93.98,16.83 87.31,16.83 87,17.14 87,20.32 85.72,21.59 IC1.20
  Top 0.254: 97.63,60.01 90.49,60.01 89.53,59.05 89.53,56.39 IC2.20
  Bottom 0.203: v93.98,16.83 93.98,13.65 93.03,12.7 73.66,12.7 73.03,13.34 40.32,13.34 39.69,12.7 v38.1,12.7
CPU_D7  (via drill 0.38)
  Top 0.203: v36.83,11.43 36.83,14.61 37.47,15.24 37.47,27.46 46.99,36.99 IC3.15 | v88.27,53.66 88.27,56.29 | IC1.21 88.27,24.45 v89.53,23.18 90.81,24.45 90.81,29.21 89.22,30.8 89.22,38.1 89.85,38.73 89.85,39.61 v89.93,39.69
  Top 0.254: 88.27,56.29 IC2.21
  Bottom 0.203: v89.93,39.69 89.22,39.69 88.58,40.32 88.58,53.34 v88.27,53.66 | v89.53,23.18 87.63,21.27 73.98,21.27 70.48,17.78 47.62,17.78 46.35,19.05 43.18,19.05 36.83,12.7 v36.83,11.43 37.82,10.44 JP1.39
CPU_IORQ  (via drill 0.38)
  Top 0.203: v72.39,11.43 72.39,12.06 71.44,13.02 71.44,34.61
  Top 0.254: 71.44,34.61 70.56,35.49 IC3.58
  Bottom 0.203: JP1.11 73.38,10.44 v72.39,11.43
CPU_M1  (via drill 0.38)
  Top 0.203: 72.07,35.24 72.07,14.61 74.93,11.75 75.56,11.75 v75.88,11.43
  Top 0.254: 72.07,35.24 71.33,35.99 IC3.59
  Bottom 0.203: JP1.9 75.92,6.35 | 75.92,6.35 75.92,10.44 | v75.88,11.43 75.88,6.39 75.92,6.35
CPU_RD  (via drill 0.38)
  Top 0.203: 70.8,33.81 v70.8,22.23 70.8,12.38 70.84,12.34 JP1.14 | IC1.24 84.14,28.26 v83.19,27.3 | v84.45,54.61 84.45,56.29 IC2.24
  Top 0.254: 70.8,33.81 70.17,34.45 65.93,34.45 IC3.56
  Bottom 0.203: v70.8,22.23 71.12,22.54 80.64,22.54 82.55,24.45 82.55,26.35 83.19,26.99 v83.19,27.3 83.5,26.99 96.84,26.99 97.31,27.46 97.31,40.16 94.61,42.86 92.39,42.86 90.81,44.45 90.81,52.7 88.9,54.61 v84.45,54.61
CPU_WR  (via drill 0.38)
  Top 0.203: v69.85,11.43 70.17,11.75 70.17,33.34
  Top 0.254: 70.17,33.34 69.53,33.97 65.91,33.97 IC3.55
  Bottom 0.203: JP1.13 70.84,10.44 v69.85,11.43
DIS_MR_MP  (via drill 0.38)
  Top 0.254: IC3.2 47.61,43.49 v47.31,43.18 46.35,42.23 45.45,42.23 R8.1
  Bottom 0.203: v47.31,43.18 47.62,43.5 47.62,54.29 53.66,60.33 70.44,60.33 S1.2
GND  (via drill 0.5, 0.7)
  Top 0.203: IC3.44 61,33.3 | IC3.31 54.5,31.86
  Top 0.254: IC3.21 52.37,33.99 v52.39,33.97 | IC3.84 60,44.46 60.01,44.45 | IC3.75 64.62,43.99 64.45,43.81 | IC3.69 64.48,40.99 64.45,40.96 | IC3.62 64.16,37.49 64.14,37.47 | IC3.100 52,43.57 52.39,43.18 | 54.5,31.86 54.29,32.07
  Top 0.406: IC2.16 93.29,41.33 v93.34,41.27 | SD1.3 25.86,31.29
  Top 0.61: v29.53,32.54 32.86,32.54 33.34,33.02 33.34,35.13 SD1.6
  Top 0.813: C2.- 24.46,17.16 24.77,17.46 26.4,17.46 C1.-
  Bottom 0.406: SD2.6 22.19,33.05 v24.13,31.11
  Bottom 0.61: SD2.3 29.37,32.7 v29.53,32.54
  Bottom 0.813: C1.- 26.72,17.78 31.43,17.78 32.7,16.51 32.7,11.15 32.74,11.11 | JP1.43 32.74,11.11 | 32.74,11.11 32.74,11.15 33.02,11.43 34.92,11.43 35.24,11.11 35.24,5.75 JP1.41 | v54.93,38.1 C8.1 | C9.1 78.11,35.24
  other vias: 95.25,15.56 96.52,14.61 95.25,13.97 89.85,41.27 88.42,38.26 89.22,15.56 90.49,15.56 91.12,21.91 87.31,22.86 94.93,28.89 93.98,28.89 93.03,28.89 93.66,45.72 93.34,54.29 93.34,53.02 76.83,50.48 77.79,50.48 75.56,52.39 76.52,52.39 69.22,52.7 69.22,51.75 66.36,52.7 66.36,51.75 66.36,48.9 66.36,47.94 66.36,46.99 58.1,57.47 56.52,58.42 46.04,29.53 46.04,28.57 34.29,15.88 35.24,15.88 35.24,14.92 34.29,14.92 49.37,29.21 51.12,29.21 49.37,30.16 51.12,30.16 11.11,47.31 12.06,47.31 13.02,47.31 13.97,47.31 11.11,48.9 12.06,48.9 13.02,48.9 13.97,48.9 1.59,24.45 2.54,24.45 3.49,24.45 4.45,24.45 33.97,53.66 33.97,52.7 33.97,51.75 33.97,50.8 35.56,53.66 35.56,52.7 35.56,51.75 35.56,50.8 90.81,37.47 91.76,37.47 92.71,37.47 93.66,37.47 94.61,37.47 95.89,28.89 92.08,28.89 90.49,18.1 89.22,18.1 89.85,28.89 83.19,47.62 82.23,47.62 81.28,47.62 75.56,47.62 76.52,47.62 77.47,47.62 54.61,32.07 80.96,59.05 81.92,59.05 82.87,59.05 87.63,59.05 88.58,59.05 66.36,56.52 66.36,55.56
  pour Top (rank 2): -0.64,65.09 100.97,65.09 100.97,11.11 -0.64,11.11
  pour Bottom (rank 2): -1.59,66.04 101.92,66.04 101.92,11.11 -1.59,11.11
N$1
  Top 0.61: JP1.46 30.2,11.47 30.48,11.75 32.07,11.75 32.7,11.11 32.7,6.77 JP1.44
N$2
  Top 0.203: JP1.8 78.42,5.71 J1.1
N$4
  Top 0.254: R1.2 52.79,60.77 T1.B
N$5
  Top 0.254: R2.1 53.89,54.74 T2.B
N$7
  Top 0.203: D2.K 44.13,54.61 45.09,53.66 R3.2
  Bottom 0.254: D1.K D2.K
N$8
  Top 0.406: D1.A 50.4,61.53 T1.C
N$9
  Top 0.406: D2.A 50.45,56.9 T2.C
RAM_A13  (via drill 0.38)
  Top 0.203: IC2.28 79.32,59 v79.38,59.05 | IC3.70 68.16,41.49 v68.26,41.59
  Bottom 0.203: v79.38,59.05 78.74,59.05 77.47,57.78 74.93,57.78 73.98,58.74 67.94,58.74 67.63,58.42 67.63,44.77 68.58,43.81 68.58,41.91 v68.26,41.59
RAM_A14
  Top 0.203: IC2.3 76.78,41.86 76.2,41.27 71.75,41.27 69.53,43.5 69.53,47.31 66.99,49.85 62.55,49.85 61.5,48.8 IC3.81
RAM_A15  (via drill 0.38)
  Top 0.203: IC2.31 75.51,58.37 v75.56,58.42 | IC3.82 61,49.49 v60.96,49.53
  Bottom 0.203: v75.56,58.42 75.25,58.74 74.61,58.74 74.14,59.21 66.2,59.21 61.28,54.29 61.28,49.85 v60.96,49.53
RAM_A16
  Top 0.203: IC2.2 75.51,42.18 75.25,41.91 72.07,41.91 70.01,43.97 70.01,47.78 67.47,50.32 64.61,50.32 63.18,51.75 60.48,51.75 59.5,50.77 IC3.85
RAM_A17  (via drill 0.38)
  Top 0.203: IC2.30 76.78,58.69 v77.15,59.05 | IC3.86 59,49.91 v58.74,50.16
  Bottom 0.203: v77.15,59.05 76.52,59.05 75.88,59.69 66.04,59.69 60.33,53.98 60.33,53.02 58.74,51.44 v58.74,50.16
RAM_A18
  Top 0.203: IC2.1 74.24,42.81 73.98,42.55 72.39,42.55 70.48,44.45 70.48,48.26 70.17,48.58 69.85,48.58 67.63,50.8 65.09,50.8 63.5,52.39 60.33,52.39 59.37,51.44 59.05,51.44 57.78,50.16 57.78,48.26 58.5,47.55 IC3.87
RAM_CS  (via drill 0.38)
  Top 0.203: IC2.22 86.94,59.42 86.36,60.01 74.3,60.01 71.75,57.47 v62.87,57.47 | v56.83,49.21 56.83,48.26 57.5,47.59 IC3.89
  Bottom 0.203: v62.87,57.47 57.47,52.07 57.47,49.85 v56.83,49.21
RAM_WE  (via drill 0.38)
  Top 0.203: IC2.29 78.05,51.7 77.79,51.44 71.12,51.44 70.8,51.12 70.8,48.9 71.44,48.26 71.44,45.09 v73.03,43.5 | IC3.65 67.38,38.99 67.47,38.89 v69.53,38.89
  Bottom 0.203: v73.03,43.5 73.03,40.64 71.75,39.37 70.01,39.37 v69.53,38.89
RESET  (via drill 0.38)
  Top 0.203: v67.31,11.43 67.31,28.57 v66.99,28.89
  Top 0.254: v50.48,45.4 50.48,46.99 50.8,47.31 52.23,47.31 52.5,47.04 IC3.99
  Bottom 0.203: v66.99,28.89 59.05,28.89 57.78,30.16 52.7,30.16 51.44,31.43 51.44,44.45 | JP1.15 68.3,10.44 v67.31,11.43
  Bottom 0.254: 51.44,44.45 v50.48,45.4
ROM_A14  (via drill 0.38)
  Top 0.203: v86.68,46.67 84.14,49.21 76.83,49.21 75.88,50.16 v71.44,50.16 | IC3.78 63,48.08 v63.82,48.9 | IC1.29 87.61,36.18 v87.63,36.2
  Bottom 0.203: v87.63,36.2 86.68,37.15 v86.68,46.67 | v63.82,48.9 64.45,48.9 65.09,48.26 65.09,41.27 65.41,40.96 68.9,40.96 69.53,41.59 69.53,48.9 70.8,50.16 v71.44,50.16
ROM_A15  (via drill 0.38)
  Top 0.203: IC3.79 62.5,43.87 v62.55,43.81 | IC1.3 79.38,37.78 77.15,37.78 76.83,37.47 73.34,37.47 v72.39,38.42
  Bottom 0.203: v62.55,43.81 62.55,40.64 65.41,37.78 71.75,37.78 v72.39,38.42
ROM_A16  (via drill 0.38)
  Top 0.203: 80.64,37.15 80.64,37.78 80.01,38.42 78.42,38.42 78.26,38.26 v73.5,38.26 | v61.59,43.81 62,44.22 IC3.80
  Top 0.254: 80.64,37.15 IC1.2
  Bottom 0.203: v73.5,38.26 72.39,37.15 65.09,37.15 61.59,40.64 v61.59,43.81
ROM_A17
  Top 0.203: IC3.67 71.46,39.99 71.75,39.69 78.11,39.69 78.9,38.89 81.92,38.89 82.55,38.26 82.55,35.24 82.87,34.92 83.82,34.92 84.14,34.61 85.41,34.61
  Top 0.254: 85.41,34.61 85.72,34.92 IC1.30
ROM_CS  (via drill 0.38)
  Top 0.203: IC1.22 v89.53,25.72 | IC3.77 63.5,47.62 v63.82,47.94
  Bottom 0.203: v89.53,25.72 96.52,25.72 97.79,26.99 97.79,40.32 94.61,43.5 92.71,43.5 91.44,44.77 91.44,52.7 88.58,55.56 73.98,55.56 73.03,54.61 73.03,47.94 72.39,47.31 72.39,43.5 69.37,40.48 64.61,40.48 64.14,40.96 64.14,47.62 v63.82,47.94
ROM_WE  (via drill 0.38)
  Top 0.203: v67.63,43.18 70.33,40.48 78.58,40.48 78.74,40.64 79.06,40.96 84.14,40.96 84.45,40.64 IC1.31 | v66.04,45.4 65.72,45.72 64.16,45.72 IC3.76
  Bottom 0.203: v67.63,43.18 66.67,43.18 65.72,44.13 65.72,45.09 v66.04,45.4
SD_CD0  (via drill 0.38)
  Top 0.203: SD1.CD 38.76,33.37 v37.78,32.38 36.83,31.43 34.56,31.43 R4.1 | IC3.10 48.38,39.49 v46.04,37.15
  Bottom 0.203: v37.78,32.38 41.27,32.38 v46.04,37.15
SD_CD1  (via drill 0.38, 0.5)
  Top 0.203: v48.9,45.4 48.9,47.31 49.37,47.78 53.5,47.78 54,47.28 IC3.96 | v22.86,30.8 21.63,30.8 R6.1
  Bottom 0.203: v48.9,45.4 50.16,44.13 50.16,28.57 46.67,25.08 29.53,25.08 27.94,26.67 26.99,26.67 v22.86,30.8 21.27,32.38 16.83,32.38 16.47,32.74 SD2.CD
SD_CS0  (via drill 0.38)
  Top 0.203: R1.1 57.98,60.77 59.69,59.05 59.69,53.02 55.5,48.83 v55.5,47.61 IC3.93 | v55.24,52.7 48.9,52.7 46.51,50.32 40.16,50.32 37.78,47.94 v30.8,47.94 | SD1.1 20.95,34.93 20.95,38.1 v24.77,41.91
  Bottom 0.203: v55.5,47.61 55.5,48.64 55.24,48.9 v55.24,52.7 | v30.8,47.94 v24.77,41.91
SD_CS1  (via drill 0.38)
  Top 0.203: R2.2 57.85,51.81 54.68,48.65 54.68,48.01 | IC3.94 55,46.92 54.68,47.24 54.68,48.01 | 54.68,48.01 54.61,47.94 53.98,47.94 53.66,48.26 48.9,48.26 48.26,47.62 43.81,47.62 v41.91,45.72
  Bottom 0.203: v41.91,45.72 41.91,44.77 40.96,44.77 34.37,38.18 SD2.1
SD_MISO  (via drill 0.38)
  Top 0.203: v35.24,41.27 35.56,40.96 v39.05,40.96 46.04,40.96 47.57,42.49 IC3.4 | SD1.7 35.86,37.16 35.56,37.47 v35.56,38.1
  Bottom 0.203: v35.24,41.27 34.92,40.96 20.64,40.96 19.68,40.01 19.68,37.78 19.37,37.47 SD2.7 | v35.56,38.1 35.56,38.58 36.35,39.37 37.47,39.37 v39.05,40.96
SD_MOSI  (via drill 0.38)
  Top 0.203: IC3.7 47.97,40.99 46.83,39.85 34.45,39.85 34.13,40.16 33.18,40.16 v31.75,38.73 | SD1.2 23.36,38.28 v23.81,38.73
  Bottom 0.203: SD2.2 31.75,35.28 v31.75,38.73 v23.81,38.73
SD_SCLK  (via drill 0.38)
  Top 0.203: IC3.6 47.2,41.49 46.04,40.32 34.92,40.32 34.61,40.64 32.38,40.64 30.48,38.73 30.48,38.1 v30.16,37.78 30.86,37.08 SD1.5
  Bottom 0.203: SD2.5 24.37,37.07 25.08,37.78 v30.16,37.78
SD_WP0  (via drill 0.38)
  Top 0.203: R5.1 35.56,27.94 39.96,32.34 SD1.WP 41.05,35.16 v41.27,34.92 | IC3.9 48.24,39.99 46.35,38.1 45.72,38.1 v45.09,37.47
  Bottom 0.203: v41.27,34.92 42.55,34.92 v45.09,37.47
SD_WP1  (via drill 0.38)
  Top 0.203: v20.64,39.37 14.61,39.37 13.97,38.73 13.97,33.66 v16.19,31.43 16.84,30.79 R7.1 | IC3.8 48.1,40.49 46.98,39.37 v33.66,39.37
  Bottom 0.203: v20.64,39.37 20.95,39.69 33.34,39.69 v33.66,39.37 | 15.27,32.42 16.23,31.46 v16.19,31.43
  Bottom 0.254: SD2.WP 15.27,32.42
SEL_MR_MP  (via drill 0.38)
  Top 0.254: IC3.1 47.77,43.99 v46.99,44.77 45.45,44.77 R9.1
  Bottom 0.203: v46.99,44.77 46.99,54.61 53.18,60.8 62.71,60.8 65.72,63.82 83.91,63.82 S2.2
SLTSL
  Top 0.203: IC3.66 69.01,39.49 69.06,39.53 70.33,39.53 73.18,36.67 73.18,14.92 75.25,12.86 83.03,12.86 83.54,12.34 JP1.4
TCK  (via drill 0.38)
  Top 0.203: IC3.48 63,34.16 v62.87,34.29 | v13.02,52.07 21.27,52.07 28.26,45.09 40.01,45.09 43.34,48.42 48.1,48.42 48.58,48.9 v53.02,48.9
  Bottom 0.203: v62.87,34.29 61.28,35.88 54.61,35.88 53.66,36.83 53.66,48.26 v53.02,48.9 | v13.02,52.07 7.94,52.07 7.62,52.39 4.12,52.39 JT1.1
TDI  (via drill 0.38)
  Top 0.203: IC3.45 61.5,33.75 v60.96,34.29 | v10.16,62.55 10.16,58.42 13.65,54.93 20.95,54.93 29.53,46.35 38.73,46.35 41.75,49.37 47.15,49.37 47.94,50.16 v51.75,50.16
  Bottom 0.203: v60.96,34.29 60.64,34.61 53.66,34.61 52.39,35.88 52.39,47.31 51.75,47.94 v51.75,50.16 | v10.16,62.55 4.12,62.55 JT1.9
TDO  (via drill 0.38)
  Top 0.203: IC3.83 60.5,48.09 v60.33,48.26 | v56.2,51.12 48.26,51.12 46.99,49.85 40.96,49.85 38.1,46.99 29.84,46.99 v23.81,53.02
  Bottom 0.203: v60.33,48.26 59.69,47.62 56.52,47.62 55.88,48.26 55.88,50.8 v56.2,51.12 | v23.81,53.02 9.53,53.02 7.62,54.93 4.12,54.93 JT1.3
TMS  (via drill 0.38)
  Top 0.203: IC3.47 62.5,33.7 v61.91,34.29 | v9.84,57.47 13.34,53.98 20.95,53.98 29.21,45.72 39.37,45.72 42.55,48.9 47.62,48.9 48.26,49.53 v52.39,49.53
  Bottom 0.203: v61.91,34.29 60.96,35.24 54.29,35.24 53.02,36.51 53.02,47.31 52.39,47.94 v52.39,49.53 | v9.84,57.47 4.12,57.47 JT1.5
VCC  (via drill 0.7)
  Top 0.61: v79.38,39.69 82.55,39.69 83.19,39.05 IC1.32 | 71.14,56.34 C10.2 | 74.24,54.03 v74.3,53.98 | 2.86,40.37 IC4.3
  Top 0.813: C2.+ 28.56,14.59 27.94,13.97 C1.+ 22.05,13.97 21.66,14.36 | v74.3,53.98 63.5,53.98 61.59,55.88 v61.59,61.59 | 74.24,54.03 IC2.32 71.14,56.34 | 2.86,40.37 2.86,28.89 5.4,26.35 11.11,26.35 12.38,25.08 12.38,13.97 13.02,13.34 20.64,13.34 21.66,14.36 | v1.91,50.16 0.95,49.21 0.95,40.96 1.38,40.53 IC4.3 4.24,40.53 4.76,40.01 4.76,38.42 C4.2 | IC5.3 19.93,18.49 20.32,18.1 20.32,15.7 C3.2 21.66,14.36
  Bottom 0.813: C1.+ 26.47,12.59 27.62,11.43 | 27.62,11.43 27.62,5.75 JP1.47 | JP1.45 30.2,11.39 29.84,11.75 27.94,11.75 27.62,11.43 | v74.3,53.98 78.74,53.98 79.38,53.34 v79.38,39.69 79.38,39.05 C9.2 | v61.59,61.59 60.33,62.87 36.2,62.87 23.5,50.16 v1.91,50.16
VCCINT  (via drill 0.7)
  Top 0.203: IC3.26 52,31.68 | IC3.38 58,32.49 | IC3.5 51.99,41.99 | IC3.57 64.07,34.99 | IC3.51 64.53,31.99 | IC3.88 58,44.34 | IC3.98 53,44.48
  Top 0.254: 51.99,41.99 52.07,41.91 | 53,44.48 53.02,44.45 | 58,44.34 57.78,44.13
  Top 0.61: 52.07,41.91 52.7,41.27 53.02,41.27 | 53.02,41.27 v55.24,41.27 58.74,41.27 59.69,40.32 59.69,39.37 63.82,35.24 | 53,44.48 53,44.16 53.34,43.81 v54.61,43.81 57.47,43.81 57.78,44.13 | v54.29,57.78 52.74,57.78 T2.E 52.31,57.86 51.44,58.74 45.4,58.74 | v45.4,55.56 45.4,58.74 | 52,31.68 53.34,33.02 | 53.34,33.02 57.47,33.02 58,32.49 | 53.34,33.02 53.34,40.96 53.02,41.27 | 64.07,34.99 63.82,35.24 | 64.53,31.99 63.82,32.7 63.82,35.24 | R8.2 | 9.55,43.18 IC4.4 | 6.95,42.88 6.99,42.84 | T1.E 52.39,62.55 52.07,62.87 45.72,62.87 45.4,62.55 45.4,58.74
  Top 0.813: 43.5,43.18 v43.5,45.72 R9.2 | 43.5,43.18 R8.2 | 43.5,43.18 12.38,43.18 | 12.38,43.18 9.55,43.18 | IC4.2 6.99,42.84 IC4.4 | 6.95,42.88 C7.2 9.21,50.09 9.21,54.29 8.59,54.91 JT1.4 | v19.05,26.67 26.35,19.37 X1.4 | v14.29,26.67 12.38,28.57 12.38,43.18
  Bottom 0.61: v55.24,41.27 58.74,41.27 59.69,40.32 59.69,38.74 C8.2 | v54.61,43.81 54.61,47.62 54.29,47.94 v54.29,57.78 | v45.4,55.56 44.13,55.56 43.5,54.93 v43.5,45.72
  Bottom 0.813: v55.24,41.27 55.24,42.23 54.61,42.86 v54.61,43.81 | v19.05,26.67 v14.29,26.67

### Text on the board
tPlace: GND | Vref | GND | FBLabs SD Mapper V2 | Licenced under CERN OHL v1.1 | PCB by Sturaro / FW by FRS | / | Made in Brazil
bPlace: TDI | TMS | TDO | TCK